# Altium schematic sheet FPGA_Systems_Program.SchDoc
size A3; SheetNumber: 5; SheetTotal: 10
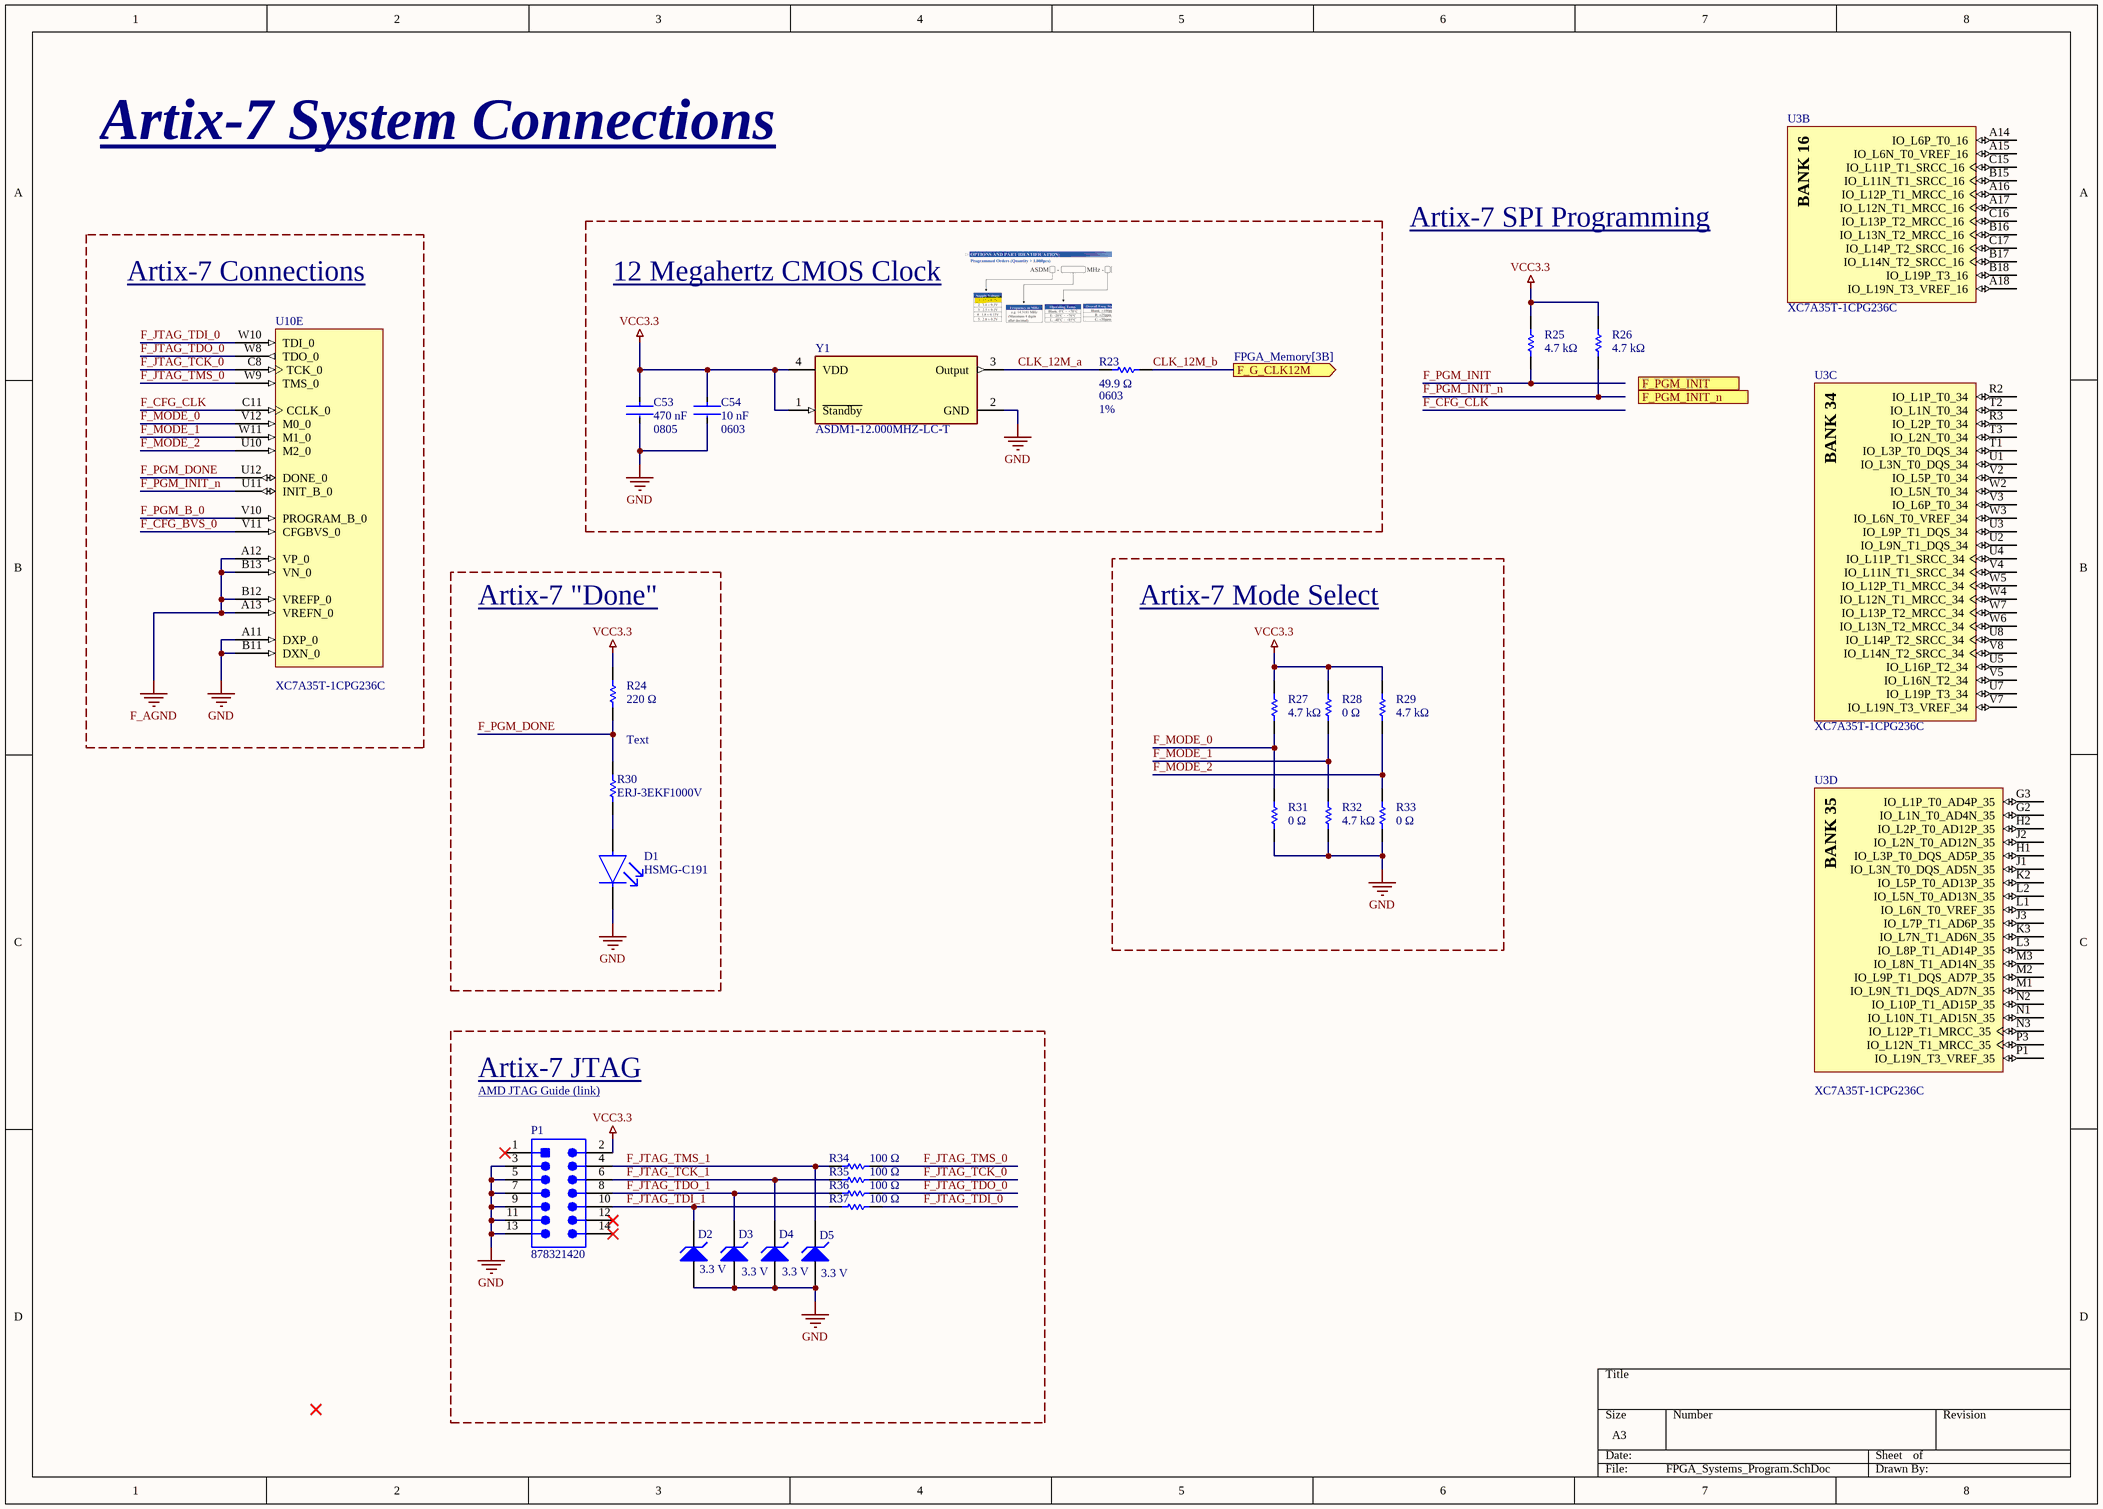
[diagram p0: FPGA_Systems_Program.SchDoc]

## Parts
C53  Case Code (Imperial): 0805  Capacitance: 470 nF  [FP-CGA4J-IPC_A]  (hidden comment: CGA4J3X7R1H474M125AE)
C54  Case Code (Imperial): 0603  Capacitance: 10 nF  [FP-0603-L_1_6_0_1-W_0_8_0-MFG]  (hidden comment: EMK107SD103KA-T)
D1  HSMG-C191  [FP-HSMG-C191-MFG]
D2  VZ Typ (V): 3.3 V  [ONSC-SMB-2-403A-03_H_V]  (hidden comment: 1SMB5913BT3G)
D3  VZ Typ (V): 3.3 V  [ONSC-SMB-2-403A-03_H_V]  (hidden comment: 1SMB5913BT3G)
D4  VZ Typ (V): 3.3 V  [ONSC-SMB-2-403A-03_H_V]  (hidden comment: 1SMB5913BT3G)
D5  VZ Typ (V): 3.3 V  [ONSC-SMB-2-403A-03_H_V]  (hidden comment: 1SMB5913BT3G)
P1  878321420  [MOLX-878321420_V]
R23  value 49.9 Ω  PackageReference: 0603  Tolerance: 1%  [RESC1608X55X25NL10T15]  (hidden comment: RC0603FR-0749R9L)
R24  Resistance: 220 Ω  [RESC1608X55X30LL15T15]  (hidden comment: ERJ-3EKF2200V)
R25  Resistance: 4.7 kΩ  [RESC1608X55X30LL15T15]  (hidden comment: ERJ-3EKF4701V)
R26  Resistance: 4.7 kΩ  [RESC1608X55X30LL15T15]  (hidden comment: ERJ-3EKF4701V)
R27  Resistance: 4.7 kΩ  [RESC1608X55X30LL15T15]  (hidden comment: ERJ-3EKF4701V)
R28  Resistance: 0 Ω  [RESC1608X55X30LL15T15]  (hidden comment: ERJ-3EKF4701V)  (no BOM)
R29  Resistance: 4.7 kΩ  [RESC1608X55X30LL15T15]  (hidden comment: ERJ-3EKF4701V)
R30  ERJ-3EKF1000V  [RESC1608X55X30LL15T15]
R31  Resistance: 0 Ω  [RESC1608X55X30LL15T15]  (hidden comment: ERJ-3EKF4701V)
R32  Resistance: 4.7 kΩ  [RESC1608X55X30LL15T15]  (hidden comment: ERJ-3EKF4701V)
R33  Resistance: 0 Ω  [RESC1608X55X30LL15T15]  (hidden comment: ERJ-3EKF4701V)  (no BOM)
R34  value 100 Ω  [RESC1608X55X30LL15T15]  (hidden comment: ERJ-3EKF1000V)
R35  value 100 Ω  [RESC1608X55X30LL15T15]  (hidden comment: ERJ-3EKF1000V)
R36  value 100 Ω  [RESC1608X55X30LL15T15]  (hidden comment: ERJ-3EKF1000V)
R37  value 100 Ω  [RESC1608X55X30LL15T15]  (hidden comment: ERJ-3EKF1000V)
U3  XC7A35T-1CPG236C  [CPG236]  (parts B,C,D of 10)
U10  XC7A35T-1CPG236C  [CPG236]  (part E of 10)
Y1  ASDM1-12.000MHZ-LC-T  [FP-ASDM-ASDMB-MFG]

## Blocks framed on the sheet
Artix-7 Connections: U10
12 Megahertz CMOS Clock: C53 C54 R23 Y1
Artix-7 Mode Select: R27-R29 R31-R33
Artix-7 "Done": D1 R24 R30
Artix-7 JTAG: D2-D5 P1 R34-R37

## Ports
F_G_CLK12M (out, see FPGA_Memory[3B]), F_PGM_INIT, F_PGM_INIT_n

## Nets
F_AGND: U10.A12(VP_0) U10.A13(VREFN_0) U10.B12(VREFP_0) U10.B13(VN_0)
GND: C53.2 C54.2 D1.1(C) D2.2(A) D3.2(A) D4.2(A) D5.2(A) P1.3 P1.5 P1.7 P1.9 P1.11 P1.13 R31.1 R32.1 R33.1 U10.A11(DXP_0) U10.B11(DXN_0) Y1.2(GND)
VCC3.3: C53.1 C54.1 P1.2 R24.2 R25.2 R26.2 R27.2 R28.2 R29.2 Y1.1(~{Standby}) Y1.4(VDD)
CLK_12M_a: R23.1 Y1.3(Output)
CLK_12M_b: R23.2 ; port F_G_CLK12M
F_CFG_BVS_0: U10.V11(CFGBVS_0)
F_CFG_CLK: U10.C11(CCLK_0)
F_JTAG_TCK_0: R35.2 U10.C8(TCK_0)
F_JTAG_TCK_1: D4.1(K) P1.6 R35.1
F_JTAG_TDI_0: R37.2 U10.W10(TDI_0)
F_JTAG_TDI_1: D2.1(K) P1.10 R37.1
F_JTAG_TDO_0: R36.2 U10.W8(TDO_0)
F_JTAG_TDO_1: D3.1(K) P1.8 R36.1
F_JTAG_TMS_0: R34.2 U10.W9(TMS_0)
F_JTAG_TMS_1: D5.1(K) P1.4 R34.1
F_MODE_0: R27.1 R31.2 U10.V12(M0_0)
F_MODE_1: R28.1 R32.2 U10.W11(M1_0)
F_MODE_2: R29.1 R33.2 U10.U10(M2_0)
F_PGM_B_0: U10.V10(PROGRAM_B_0)
F_PGM_DONE: R24.1 R30.2 U10.U12(DONE_0)
F_PGM_INIT: R25.1
F_PGM_INIT_n: R26.1 U10.U11(INIT_B_0)
NetD1_2: D1.2(A) R30.1

Not connected (* = marked no-connect by the designer): P1 1* 12* 14*; U3 A14(IO_L6P_T0_16) A15(IO_L6N_T0_VREF_16) A16(IO_L12P_T1_MRCC_16) A17(IO_L12N_T1_MRCC_16) A18(IO_L19N_T3_VREF_16) B15(IO_L11N_T1_SRCC_16) B16(IO_L13N_T2_MRCC_16) B17(IO_L14N_T2_SRCC_16) B18(IO_L19P_T3_16) C15(IO_L11P_T1_SRCC_16) C16(IO_L13P_T2_MRCC_16) C17(IO_L14P_T2_SRCC_16) G2(IO_L1N_T0_AD4N_35) G3(IO_L1P_T0_AD4P_35) H1(IO_L3P_T0_DQS_AD5P_35) H2(IO_L2P_T0_AD12P_35) J1(IO_L3N_T0_DQS_AD5N_35) J2(IO_L2N_T0_AD12N_35) J3(IO_L7P_T1_AD6P_35) K2(IO_L5P_T0_AD13P_35) K3(IO_L7N_T1_AD6N_35) L1(IO_L6N_T0_VREF_35) L2(IO_L5N_T0_AD13N_35) L3(IO_L8P_T1_AD14P_35) M1(IO_L9N_T1_DQS_AD7N_35) M2(IO_L9P_T1_DQS_AD7P_35) M3(IO_L8N_T1_AD14N_35) N1(IO_L10N_T1_AD15N_35) N2(IO_L10P_T1_AD15P_35) N3(IO_L12P_T1_MRCC_35) P1(IO_L19N_T3_VREF_35) P3(IO_L12N_T1_MRCC_35) R2(IO_L1P_T0_34) R3(IO_L2P_T0_34) T1(IO_L3P_T0_DQS_34) T2(IO_L1N_T0_34) T3(IO_L2N_T0_34) U1(IO_L3N_T0_DQS_34) U2(IO_L9N_T1_DQS_34) U3(IO_L9P_T1_DQS_34) U4(IO_L11P_T1_SRCC_34) U5(IO_L16P_T2_34) U7(IO_L19P_T3_34) U8(IO_L14P_T2_SRCC_34) V2(IO_L5P_T0_34) V3(IO_L6P_T0_34) V4(IO_L11N_T1_SRCC_34) V5(IO_L16N_T2_34) V7(IO_L19N_T3_VREF_34) V8(IO_L14N_T2_SRCC_34) W2(IO_L5N_T0_34) W3(IO_L6N_T0_VREF_34) W4(IO_L12N_T1_MRCC_34) W5(IO_L12P_T1_MRCC_34) W6(IO_L13N_T2_MRCC_34) W7(IO_L13P_T2_MRCC_34)

## Notes on the sheet
- Artix-7 System Connections
- Artix-7 SPI Programming
- Text
- AMD JTAG Guide (link) <https://docs.amd.com/r/en-US/ug1514-smartlynq-plus-module/JTAG-Target-Interface>
- (in symbol CMP-0383-00006-1, part B) BANK 16
- (in symbol CMP-0383-00006-1, part C) BANK 34
- (in symbol CMP-0383-00006-1, part D) BANK 35

## Library data of the parts
C53 = CMP-08246-001744-1: Cap Ceramic 470nF 50V X7R 20% Pad SMD 0805 +125°C Automotive T/R; Length: 2mm; Depth: 1.25mm; Features: Soft Termination; Case Code (Metric): 2012; Max Operating Temperature: 125°C; Tolerance: 20%; Termination: SMD/SMT; Mount: Surface Mount; Voltage Rating (DC): 50V; Dielectric: X7R; Thickness: 0.049inch; Width: 0.049inch; Min Operating Temperature: -55°C; Packaging: Tape and Reel; Height: 1.25mm; REACH SVHC: No SVHC; Package Quantity: 1; Weight: 0.000194oz; Case/Package: 0805; Ratings: AEC-Q200; Voltage Rating: 50V
C54 = CMP-14477-001835-2: None; Voltage Rating (DC): 16V; Tolerance: 10%; Mount: Surface Mount; Lead Free: Lead Free; Min Operating Temperature: -55°C; Resistor Type: Ceramic; Voltage Rating: 16V; Package Quantity: 1; RoHS Compliant: Yes; Case/Package: 0603; Length: 1.6mm; Radiation Hardening: No; Halogen Free: Halogen Free; Max Operating Temperature: 125°C; Thickness: 0.035inch; Termination: SMD/SMT; Case Code (Metric): 1608; Packaging: Tape and Reel; Weight: 7.1E-05oz; Width: 0.031inch; Construction: Flat; Height: 0.8mm; Depth: 0.8mm; Series: CFCAP™
D1 = CMP-18399-000001-1: LED GREEN DIFFUSED CHIP SMD; Manufacturer: Broadcom; Viewing Angle: 170°; Max Junction Temp: +95°C; Wavelength: 572nm; Peak Emmision Wavelength: 570nm; Led Orientation: Top View; Luminous Intensity: 15mcd; Reverse Voltage: 5V; Forward Current: 20mA; Forward Voltage: 2.2V; Power Dissipation: 52mW; Ipc Land Pattern Name: DIOC16080X45; Digikey Description: LED GREEN DIFFUSED CHIP SMD; Temperature Range High: +85°C; Height: 0.7mm; Automotive: No; Footprint 0 Description: SM LED; 2 Flat Leads; Device Class L3: unset; ComponentLink2Description: Datasheet; Lead Free: Yes; Package: 0; Mouser Description: LED Uni-Color Green 570nm 2-Pin Chip LED T/R; RoHS: TRUE; Category: Diode; Manufacturer Part Number: HSMG-C191; Device Class L1: Optoelectronics; Temperature Range Low: -40°C; Device Class L2: LEDs; Colour: Green; Octopart: https://octopart.com/hsmg-c191-broadcom-71131308; Temperature: -40°C to +85°C; ComponentLink2URL: https://docs.broadcom.com/docs/AV02-0551EN
D2-D5 = CMP-1060-00201-1: 3 W Zener Voltage Regulator, 2-Pin SMB, Pb-Free, Tape and Reel; Manufacturer: On Semiconductor; RoHS: Pb-Free; PackageDescription: 2-Pin Small Molded Package, J-Bend Lead, Body 4.33 x 3.625 mm; PartNumber: 1SMB5913BT3G; ComponentLink1URL: http://www.onsemi.com/; ComponentLink2Description: Datasheet; Packing: Tape and Reel; Mounting Technology: Surface Mount; DatasheetVersion: Rev. 8; ComponentLink3URL: http://www.onsemi.com/pub_link/Collateral/1SMB5913BT3-D.PDF; ComponentLink3Description: Package Specification; ComponentLink1Description: Manufacturer URL; ComponentLink2URL: http://www.onsemi.com/pub_link/Collateral/1SMB5913BT3-D.PDF; PackageReference: SMB-2-403A-03_H; PackageVersion: Rev. H, 05/2011
P1 = CMP-2000-05520-1: Male Header, Pitch 2 mm, 2 x 7 Position, Height 7.6 mm, -55 to 105 degC, RoHS; Manufacturer: Molex; Datasheet URL: http://www.molex.com/pdm_docs/sd/878321420_sd.pdf; Package Description: Male Header, Pitch 2 mm, 2 x 7 Positions, Height 7.6 mm; Manufacturer URL: http://www.molex.com/; Package Reference: 878321420; Datasheet Version: Rev. G, 01/2012; Mounting Technology: SurfaceMount
R23 = CMP-1659-00036-1: General Purpose Chip Resistor, 49.9 Ohm, +/- 1%, -55 to 155 degC, 0603 (1608 Metric), RoHS, Tape and Reel; Max Supply Voltage: 3.63 V; Case\Package: LQFP; Interface: SPI; Min Supply Voltage: 2.97 V; Packaging: Tray; ComponentLink2Description: Datasheet; ComponentLink1Description: Manufacturer URL; ComponentLink2URL: https://datasheet.ciiva.com/11808/0900766b80f96399-11808223.pdf; RoHSCompliant: true; Max Operating Temperature: 85 degC; ComponentLink1URL: http://www.yageo.com/; PackageDescription: 2-Pin Surface Mount Device, Body 1.6 x 0.8 mm; DatasheetVersion: Rev. 4, 04/2009; Min Operating Temperature: -40 degC; Package Quantity: 250; Pins: 48
R24 = CMP-2000-00335-2: Chip Resistor, 220 Ohm, +/- 1%, 0.1 W, -55 to 155 degC, 0603 (1608 Metric), RoHS, Tape and Reel; Voltage Rating: 50 V; Power Rating: 100 mW; Case\Package: 0603; ComponentLink2Description: Datasheet; PackageDescription: 2-Pin Surface Mount Device, Body 1.6 x 0.85 mm; PackageReference: 0603; ComponentLink1Description: Manufacturer URL; ComponentLink2URL: http://industrial.panasonic.com/cdbs/www-data/pdf/RDA0000/AOA0000C86.pdf; Height: 0.45 mm; Mount: Surface Mount; Case Code (Metric): 1608; Pins: 2; Width: 0.8 mm; Length: 1.6 mm; Package Quantity: 5000; Tolerance: 1%; ComponentLink1URL: http://www.panasonic.com/; Max Operating Temperature: 155 degC; Min Operating Temperature: -55 degC; RoHSCompliant: true; Packaging: Tape and Reel; Case Code (Imperial): 0603; DatasheetVersion: Apr-15; REACH SVHC: No SVHC; Voltage Rating (DC): 50 V
R25-R29 R31-R33 = CMP-009-00185-1: Fixed Resistor, Metal Glaze/thick Film, 0.1W, 4700ohm, 75V, 1% +/-Tol, 100ppm/Cel, Surface Mount, 0603; Power: 100mW; Value: 4.7k; Max Operating Temperature: 155°C; Tolerance: 1%; Mounting Technology: Surface Mount; RoHS Compliant: Yes; Min Operating Temperature: -55°C; Case/Package: 0603; Pins: 2
R30 R34-R37 = CMP-2000-00179-1: Manufacturer: Panasonic; Part Number: ERJ-3EKF1000V
U3 U10 = CMP-0383-00006-1: Artix-7 FPGA, 106 User I/Os, 2 GTP, 238-Ball BGA, Speed Grade 1, Commercial Grade, Pb-Free; Manufacturer: Xilinx; CMTs: 5; Total Block RAM: 1800 Kb; Logic Cells: 33280; Speed Grades: 1; GTP: 2; Available User I/O: 106; ComponentLink1URL: http://www.xilinx.com/; Maximum Distributed RAM: 400 Kb; PackageVersion: Rev. 1.11; PartNumber: XC7A35T-1CPG236C; ComponentLink2URL: http://www.xilinx.com/support/documentation/data_sheets/ds180_7Series_Overview.pdf; DatasheetVersion: Rev. 1.15; ComponentLink1Description: Manufacturer URL; ComponentLink3Description: Pinout; ComponentLink4Description: Package Specification; Mounting Technology: Surface Mount; PackageReference: CPG-236; Operating Temperature Range: Commercial; PackageDescription: 238-Ball Wire-Bond Chip-Scale BGA, Body 10 x10 mm, Pitch 0.5 mm; ComponentLink3URL: http://www.xilinx.com/support/documentation/user_guides/ug475_7Series_Pkg_Pinout.pdf; ComponentLink4URL: http://www.xilinx.com/support/documentation/user_guides/ug475_7Series_Pkg_Pinout.pdf; ComponentLink2Description: Datasheet
Y1 = CMP-27762-002611-1: MEMS Oscillator 12MHz ±50ppm LVCMOS 3.3V SMD 2.5x2mm; Load Capacitance: 15pF; Min Supply Voltage: 3V; Max Supply Voltage: 3.6V; Max Supply Current: 10mA; Length: 0.098inch; Operating Supply Voltage: 3.3V; Number of Pins: 4; Packaging: Tape and Reel; Height: 0.035inch; Width: 0.079inch; Mount: Surface Mount; Case/Package: SMD/SMT; Series: Pure Silicon™ ASDM; Lead Free: Lead Free; Frequency: 12MHz; Max Operating Temperature: 85°C; RoHS Compliant: Yes; Package Quantity: 1000; Min Operating Temperature: -40°C; Operating Frequency: 12 MHz; Termination: SMD/SMT; Frequency Stability: 50ppm